# EasyEDA schematic SCH_ardiuno_2024-06-28.json
TITLE: Sheet_1; REV: 1.0; Date: 2024-06-28; Sheet: 1/1; Drawn By: thanisiabalamurugan; Company: Your Company
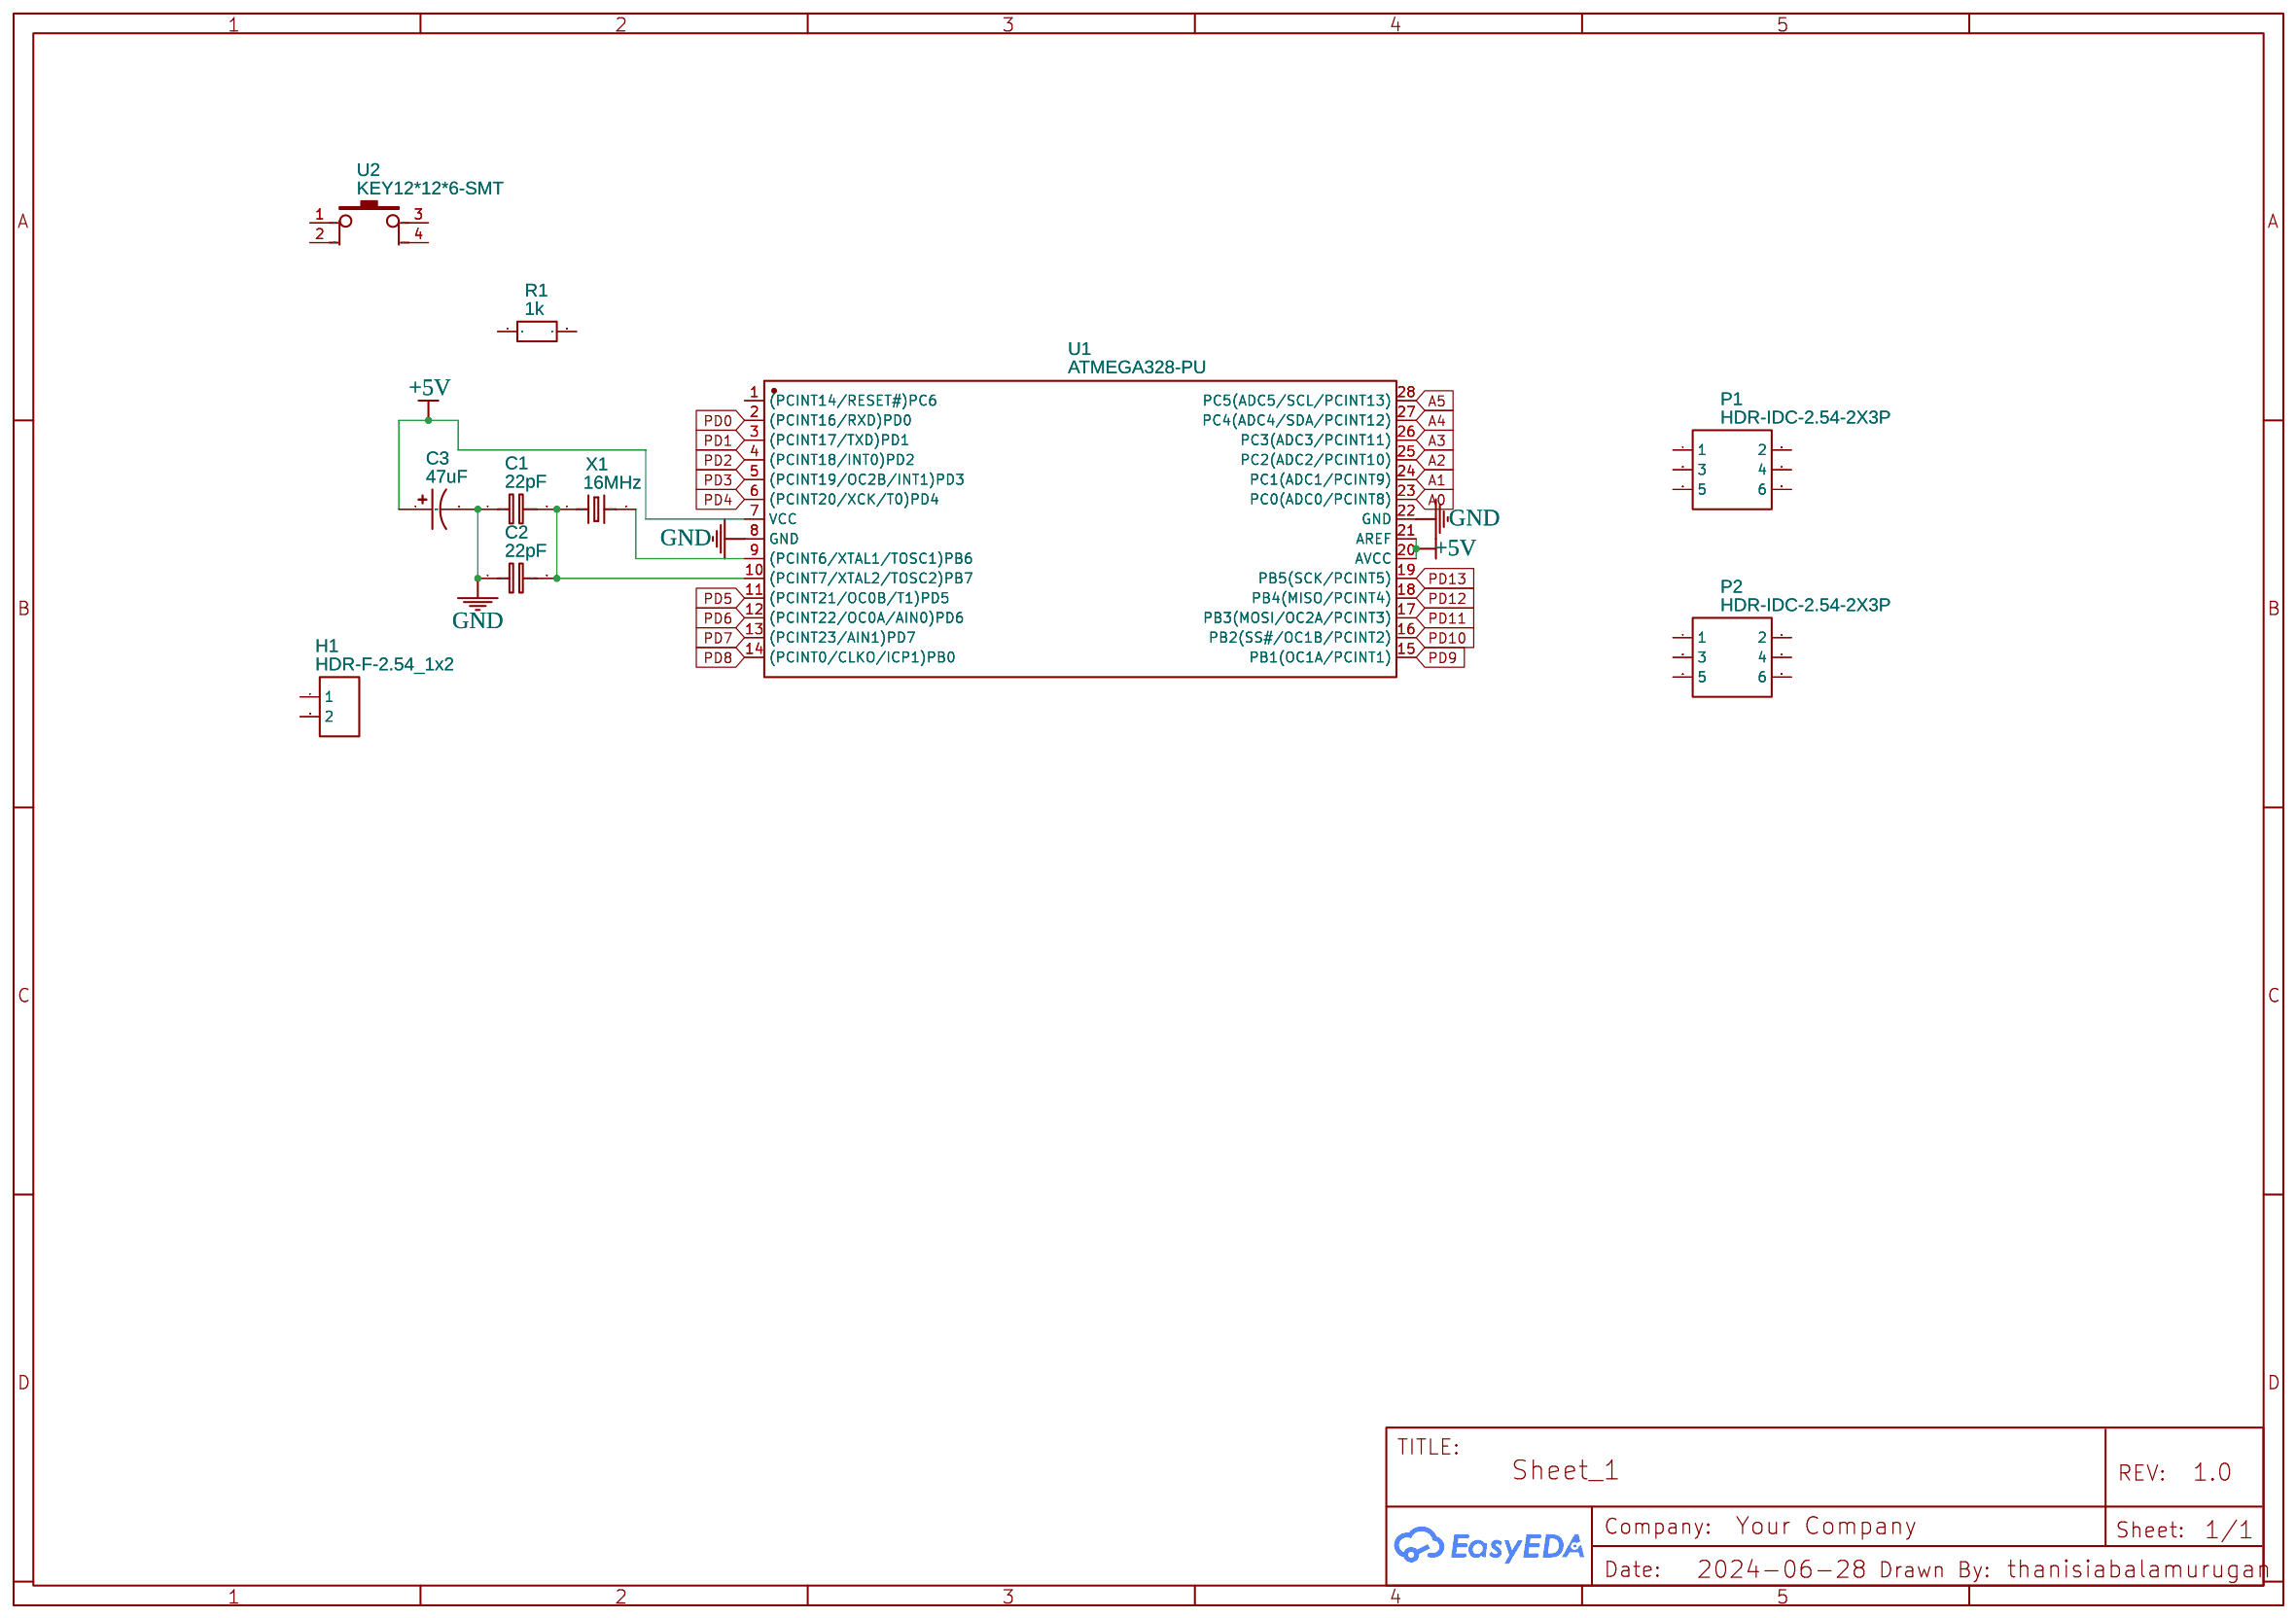
[diagram p0: schematic sheet]

## Parts
C1  22pF  [C0603]
C2  22pF  [C0603]
C3  47uF  [CASE-A_3216]
H1  HDR-F-2.54_1x2  [HDR-F-2.54_1X2]
P1  HDR-IDC-2.54-2X3P  [IDC-TH_6P-P2.54_C11214]
P2  HDR-IDC-2.54-2X3P  [IDC-TH_6P-P2.54_C11214]
R1  1k  [R0603]
U1  ATMEGA328-PU  [DIP-28_L35.0-W6.5-P2.54-LS7.6-BL]
U2  KEY12*12*6-SMT  [KEY-SMD_4P-L12.0-W12.0-P5.00-LS15.0]
X1  16MHz  [HC-49US_L11.5-W4.5-P4.88]

## Library data of the parts
C1 C2 = C_0603_EU: Contributor: LCEDA_Lib
C3 = C_Tan_SMD_A_US: Contributor: LCEDA_Lib
H1 = HDR-F-2.54_1x2: Supplier Part: C49661; Supplier: LCSC; Contributor: LCEDA_Lib
P1 P2 = HDR-IDC-2.54-2X3P: Supplier: LCSC; Manufacturer: BOOMELE; Manufacturer Part: 2X3 2.54mm IDC Box; image: //image.lceda.cn/szlcsc/C11214.jpg; Supplier Part: C11214
R1 = R_0603_EU: Contributor: LCEDA_Lib
U1 = ATMEGA328-PU: Contributor: LCSC; Supplier: LCSC; Supplier Part: C613508; Manufacturer: MICROCHIP(美国微芯); JLCPCB Part Class: Extended Part
U2 = KEY12*12*6-SMT: Contributor: LCSC; Supplier: LCSC; Supplier Part: C9900012737; Manufacturer: null; JLCPCB Part Class: Extended Part
X1 = XIHCELNANF-16MHZ: Contributor: LCSC; Supplier: LCSC; Supplier Part: C295075; Manufacturer: TAITIEN(泰艺电子); JLCPCB Part Class: Extended Part

## Nets
+5V: C3.1 U1.7(VCC) U1.20(AVCC) U1.21(AREF)
GND: C1.1 C2.1 C3.2 U1.8(GND) U1.22(GND)
A0: U1.23(PC0(ADC0/PCINT8))
A1: U1.24(PC1(ADC1/PCINT9))
A2: U1.25(PC2(ADC2/PCINT10))
A3: U1.26(PC3(ADC3/PCINT11))
A4: U1.27(PC4(ADC4/SDA/PCINT12))
A5: U1.28(PC5(ADC5/SCL/PCINT13))
PD0: U1.2((PCINT16/RXD)PD0)
PD1: U1.3((PCINT17/TXD)PD1)
PD2: U1.4((PCINT18/INT0)PD2)
PD3: U1.5((PCINT19/OC2B/INT1)PD3)
PD4: U1.6((PCINT20/XCK/T0)PD4)
PD5: U1.11((PCINT21/OC0B/T1)PD5)
PD6: U1.12((PCINT22/OC0A/AIN0)PD6)
PD7: U1.13((PCINT23/AIN1)PD7)
PD8: U1.14((PCINT0/CLKO/ICP1)PB0)
PD9: U1.15(PB1(OC1A/PCINT1))
PD10: U1.16(PB2(SS#/OC1B/PCINT2))
PD11: U1.17(PB3(MOSI/OC2A/PCINT3))
PD12: U1.18(PB4(MISO/PCINT4))
PD13: U1.19(PB5(SCK/PCINT5))
Net-(C1-2): C1.2 C2.2 U1.10((PCINT7/XTAL2/TOSC2)PB7) X1.1
Net-(U1-9): U1.9((PCINT6/XTAL1/TOSC1)PB6) X1.2

Not connected (* = marked no-connect by the designer): H1 1 2; P1 1 2 3 4 5 6; P2 1 2 3 4 5 6; R1 1 2; U1 1((PCINT14/RESET#)PC6); U2 1 2 3 4
